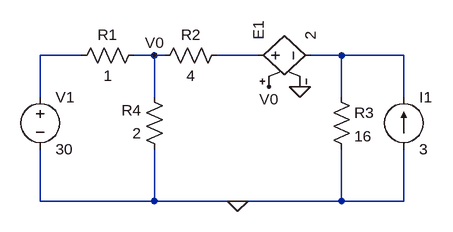
[diagram p0: schematic Draft30.asc]
Draft30.asc, the LTspice schematic file:
Version 4
SHEET 1 880 680
WIRE 112 80 48 80
WIRE 224 80 192 80
WIRE 240 80 224 80
WIRE 384 80 320 80
WIRE 512 80 464 80
WIRE 608 80 512 80
WIRE 48 144 48 80
WIRE 224 144 224 80
WIRE 512 144 512 80
WIRE 608 144 608 80
WIRE 48 304 48 224
WIRE 224 304 224 224
WIRE 224 304 48 304
WIRE 352 304 224 304
WIRE 512 304 512 224
WIRE 512 304 352 304
WIRE 608 304 608 224
WIRE 608 304 512 304
FLAG 352 304 0
FLAG 448 128 0
FLAG 224 80 V0
FLAG 400 128 V0
SYMBOL voltage 48 128 R0
SYMATTR InstName V1
SYMATTR Value 30
SYMBOL res 208 64 R90
WINDOW 0 0 56 VBottom 2
WINDOW 3 32 56 VTop 2
SYMATTR InstName R1
SYMATTR Value 1
SYMBOL res 336 64 R90
WINDOW 0 0 56 VBottom 2
WINDOW 3 32 56 VTop 2
SYMATTR InstName R2
SYMATTR Value 4
SYMBOL res 240 240 R180
WINDOW 0 36 76 Left 2
WINDOW 3 36 40 Left 2
SYMATTR InstName R4
SYMATTR Value 2
SYMBOL res 496 128 R0
SYMATTR InstName R3
SYMATTR Value 16
SYMBOL current 608 224 M180
WINDOW 0 24 80 Left 2
WINDOW 3 24 0 Left 2
SYMATTR InstName I1
SYMATTR Value 3
SYMBOL e 368 80 R270
SYMATTR InstName E1
SYMATTR Value 2

The netlist it stands for:
* Draft30.asc
V1 N001 0 30
R1 V0 N001 1
R2 N002 V0 4
R4 0 V0 2
R3 N003 0 16
I1 0 N003 3
E1 N002 N003 V0 0 2
.backanno
.end